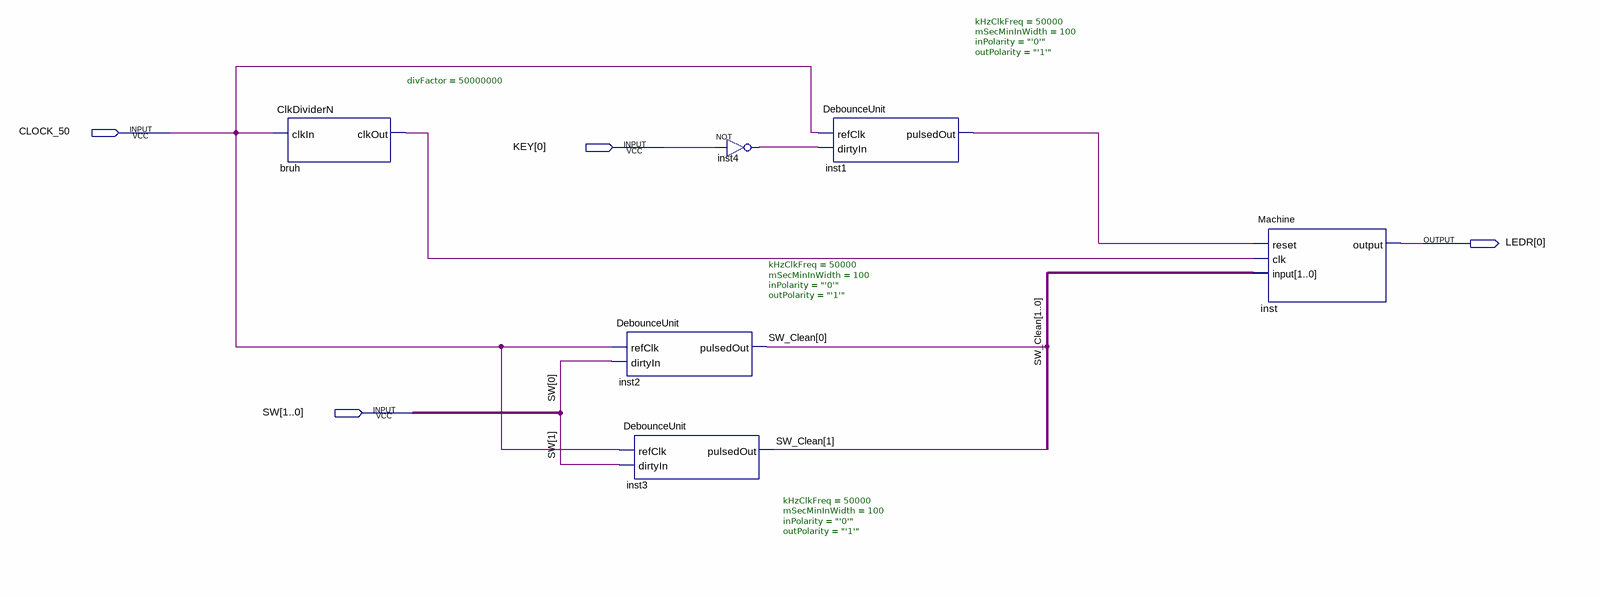
[diagram p0: schematic sheet]
// Quartus schematic DrinksMachine.bdf as structural Verilog: 6 symbols, 4 pins
module DrinksMachine (
  input  CLOCK_50,
  input  [0:0] KEY,
  input  [1:0] SW,
  output [0:0] LEDR
);

  wire bruh_clkout, inst1_pulsedout, inst4_out;
  wire [1:0] SW_Clean;

  ClkDividerN #(.divFactor(50000000)) bruh (.clkIn(CLOCK_50), .clkOut(bruh_clkout));
  DebounceUnit #(.kHzClkFreq(50000), .mSecMinInWidth(100), .inPolarity("'0'"), .outPolarity("'1'")) inst2 (
    .refClk(CLOCK_50), .dirtyIn(SW[0]), .pulsedOut(SW_Clean[0]));
  DebounceUnit #(.kHzClkFreq(50000), .mSecMinInWidth(100), .inPolarity("'0'"), .outPolarity("'1'")) inst3 (
    .refClk(CLOCK_50), .dirtyIn(SW[1]), .pulsedOut(SW_Clean[1]));
  not inst4 (inst4_out, KEY[0]);
  DebounceUnit #(.kHzClkFreq(50000), .mSecMinInWidth(100), .inPolarity("'0'"), .outPolarity("'1'")) inst1 (
    .refClk(CLOCK_50), .dirtyIn(inst4_out), .pulsedOut(inst1_pulsedout));
  Machine inst (.reset(inst1_pulsedout), .clk(bruh_clkout), .\input (SW_Clean), .\output (LEDR[0]));
endmodule
